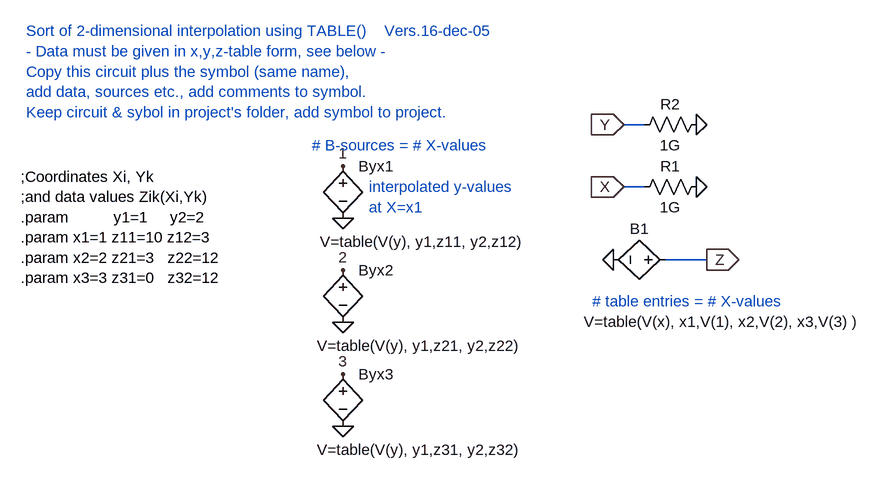
[diagram p0: schematic 2D_Interpolation_Template.asc]
2D_Interpolation_Template.asc, the LTspice schematic file:
Version 4
SHEET 1 1612 680
WIRE 784 -112 752 -112
WIRE 784 -16 752 -16
WIRE 880 96 816 96
FLAG 320 32 0
FLAG 320 -48 1
FLAG 320 192 0
FLAG 320 112 2
FLAG 736 96 0
FLAG 880 96 Z
IOPIN 880 96 Out
FLAG 320 352 0
FLAG 320 272 3
FLAG 752 -16 X
IOPIN 752 -16 In
FLAG 864 -16 0
FLAG 752 -112 Y
IOPIN 752 -112 In
FLAG 864 -112 0
SYMBOL bv 832 96 R90
WINDOW 3 80 -71 VTop 0
WINDOW 0 -32 56 VBottom 0
SYMATTR Value V=table(V(x), x1,V(1), x2,V(2), x3,V(3) )
SYMATTR InstName B1
SYMBOL bv 320 -64 R0
WINDOW 3 -35 132 Left 0
SYMATTR Value V=table(V(y), y1,z11, y2,z12)
SYMATTR InstName Byx1
SYMBOL bv 320 96 R0
WINDOW 3 -40 132 Left 0
SYMATTR Value V=table(V(y), y1,z21, y2,z22)
SYMATTR InstName Byx2
SYMBOL bv 320 256 R0
WINDOW 3 -40 132 Left 0
SYMATTR Value V=table(V(y), y1,z31, y2,z32)
SYMATTR InstName Byx3
SYMBOL res 768 0 R270
WINDOW 0 32 56 VTop 0
WINDOW 3 0 56 VBottom 0
SYMATTR InstName R1
SYMATTR Value 1G
SYMBOL res 768 -96 R270
WINDOW 0 32 56 VTop 0
WINDOW 3 0 56 VBottom 0
SYMATTR InstName R2
SYMATTR Value 1G
TEXT -176 -32 Left 0 !;Coordinates Xi, Yk\n;and data values Zik(Xi,Yk)\n.param          y1=1     y2=2\n.param x1=1 z11=10 z12=3\n.param x2=2 z21=3   z22=12\n.param x3=3 z31=0   z32=12
TEXT 704 160 Left 0 ;# table entries = # X-values
TEXT -168 -256 Left 0 ;Sort of 2-dimensional interpolation using TABLE()    Vers.16-dec-05\n- Data must be given in x,y,z-table form, see below -\nCopy this circuit plus the symbol (same name),\nadd data, sources etc., add comments to symbol.\nKeep circuit & sybol in project's folder, add symbol to project.
TEXT 272 -80 Left 0 ;# B-sources = # X-values
TEXT 360 -16 Left 0 ;interpolated y-values\nat X=x1

The netlist it stands for:
* 2D_Interpolation_Template.asc
B1 Z 0 V=table(V(x), x1,V(1), x2,V(2), x3,V(3) )
Byx1 1 0 V=table(V(y), y1,z11, y2,z12)
Byx2 2 0 V=table(V(y), y1,z21, y2,z22)
Byx3 3 0 V=table(V(y), y1,z31, y2,z32)
R1 X 0 1G
R2 Y 0 1G
;Coordinates Xi, Yk
;and data values Zik(Xi,Yk)
.param          y1=1     y2=2
.param x1=1 z11=10 z12=3
.param x2=2 z21=3   z22=12
.param x3=3 z31=0   z32=12
* # table entries = # X-values
* Sort of 2-dimensional interpolation using TABLE()    Vers.16-dec-05
* - Data must be given in x,y,z-table form, see below -
* Copy this circuit plus the symbol (same name),
* add data, sources etc., add comments to symbol.
* Keep circuit & sybol in project's folder, add symbol to project.
* # B-sources = # X-values
* interpolated y-values
* at X=x1
.backanno
.end